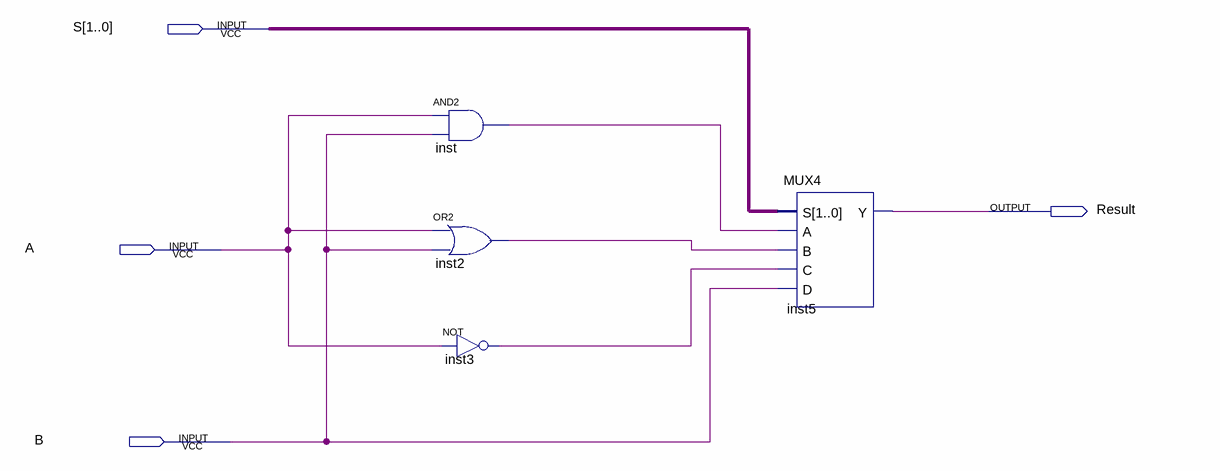
[diagram p0: schematic sheet]
// Quartus schematic BasicLogicCalculator.bdf as structural Verilog: 4 symbols, 4 pins
module BasicLogicCalculator (
  input  [1:0] S,
  input  A,
  input  B,
  output Result
);

  wire inst2_out, inst3_out, inst_out;

  and inst (inst_out, A, B);
  or inst2 (inst2_out, A, B);
  not inst3 (inst3_out, A);
  MUX4 inst5 (.S(S), .A(inst_out), .B(inst2_out), .C(inst3_out), .D(B), .Y(Result));
endmodule
